# EAGLE design SIMCOM-SIM39EA-MALE (EAGLE 9.5.1)

## Sheet 1 of 2
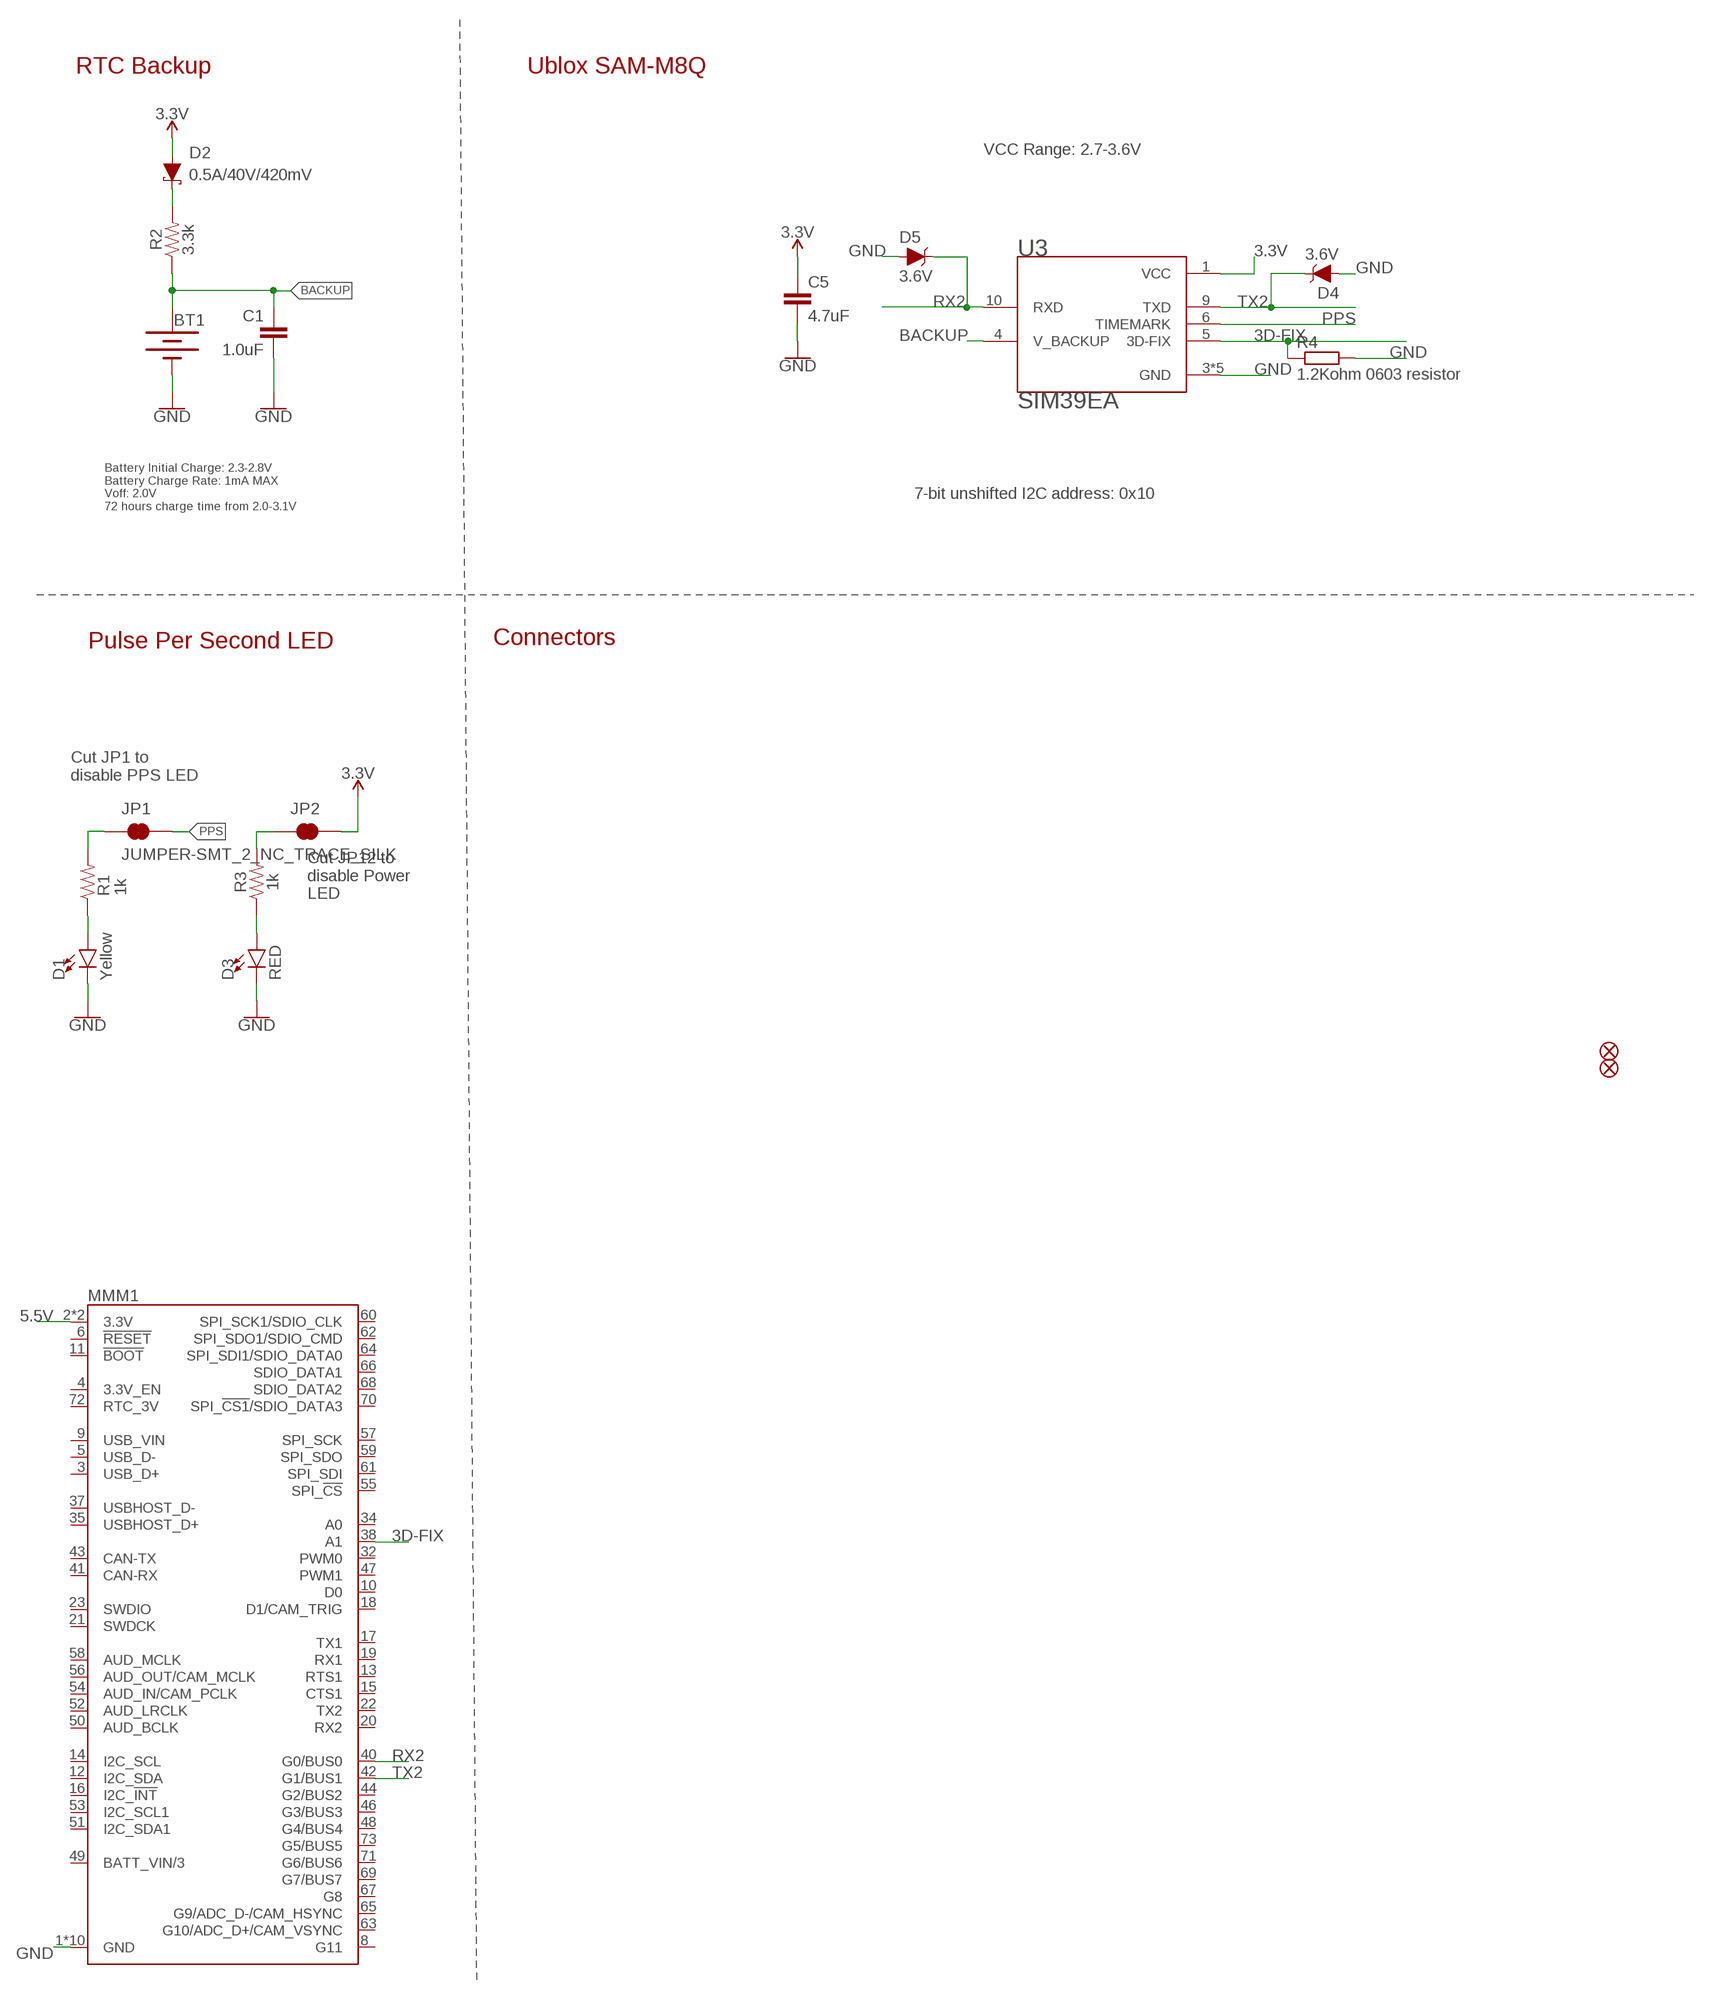
[diagram p0: schematic, sheet 1]

### Parts
BT1  6.8MM_COIN_CELL  ML414H_IV01E_BATTERY  [ML414H_IV01E]
C1  1.0uF  1.0UF-0603-16V-10%  [0603]
C5  4.7uF  4.7UF-0402_TIGHT-6.3V-20%-X5R  [0402-TIGHT]
D1  Yellow  LED-YELLOW0603  [LED-0603]
D2  0.5A/40V/420mV  DIODE-SCHOTTKY-PMEG4005EJ  [SOD-323]
D3  RED  LED-RED0603  [LED-0603]
D4  3.6V  DIODE-ZENER-BZT52C3V6S  [SOD-323]
D5  3.6V  DIODE-ZENER-BZT52C3V6S  [SOD-323]
FD3  FIDUCIALUFIDUCIAL  [FIDUCIAL-MICRO]
FD4  FIDUCIALUFIDUCIAL  [FIDUCIAL-MICRO]
JP1  JUMPER-SMT_2_NC_TRACE_SILK  [SMT-JUMPER_2_NC_TRACE_SILK]
JP2  JUMPER-SMT_2_NC_TRACE_SILK  [SMT-JUMPER_2_NC_TRACE_SILK]
MMM1  MICROMOD_4222_MALE  [MICROMOD_4222_MALE]
R1  1k  1KOHM-0603-1/10W-1%  [0603]
R2  3.3k  3.3KOHM-0603-1/10W-1%  [0603]
R3  1k  1KOHM-0603-1/10W-1%  [0603]
R4  1.2Kohm 0603 resistor  RESISTOR-0603  [R603]
U3  SIM39EA  [DFN1600X1600X750-13N]

### Nets
3.3V: C5.1 D2.A JP2.2 U3.1(VCC) ; also sheet 2
3D-FIX: MMM1.38(A1) R4.1 U3.5(3D-FIX)
5.5V: MMM1.2(3.3V) MMM1.74(3.3V) ; also sheet 2
BACKUP: BT1.+ C1.1 R2.1 U3.4(V_BACKUP)
GND: BT1.- C1.2 C5.2 D1.C D3.C D4.A D5.A MMM1.1(GND) MMM1.7(GND) MMM1.33(GND) MMM1.36(GND) MMM1.39(GND) MMM1.45(GND) MMM1.75(GND) MMM1.GND1(GND) MMM1.GND2(GND) MMM1.GND3(GND) R4.2 U3.3(GND) U3.8(GND) U3.11(GND) U3.12(GND) U3.13(GND) ; also sheet 2
N$1: JP2.1 R3.2
N$2: D1.A R1.1
N$3: D3.A R3.1
N$4: JP1.1 R1.2
N$6: D2.C R2.2
PPS: JP1.2 U3.6(TIMEMARK)
RX2: D5.C MMM1.40(G0/BUS0) U3.10(RXD)
TX2: D4.C MMM1.42(G1/BUS1) U3.9(TXD)
Unconnected: MMM1.3(USB_D+) MMM1.4(3.3V_EN) MMM1.5(USB_D-) MMM1.6(!RESET!) MMM1.8(G11) MMM1.9(USB_VIN) MMM1.10(D0) MMM1.11(!BOOT!) MMM1.12(I2C_SDA) MMM1.13(RTS1) MMM1.14(I2C_SCL) MMM1.15(CTS1) MMM1.16(I2C_!INT!) MMM1.17(TX1) MMM1.18(D1/CAM_TRIG) MMM1.19(RX1) MMM1.20(RX2) MMM1.21(SWDCK) MMM1.22(TX2) MMM1.23(SWDIO) MMM1.32(PWM0) MMM1.34(A0) MMM1.35(USBHOST_D+) MMM1.37(USBHOST_D-) MMM1.41(CAN-RX) MMM1.43(CAN-TX) MMM1.44(G2/BUS2) MMM1.46(G3/BUS3) MMM1.47(PWM1) MMM1.48(G4/BUS4) MMM1.49(BATT_VIN/3) MMM1.50(AUD_BCLK) MMM1.51(I2C_SDA1) MMM1.52(AUD_LRCLK) MMM1.53(I2C_SCL1) MMM1.54(AUD_IN/CAM_PCLK) MMM1.55(SPI_!CS!) MMM1.56(AUD_OUT/CAM_MCLK) MMM1.57(SPI_SCK) MMM1.58(AUD_MCLK) MMM1.59(SPI_SDO) MMM1.60(SPI_SCK1/SDIO_CLK) MMM1.61(SPI_SDI) MMM1.62(SPI_SDO1/SDIO_CMD) MMM1.63(G10/ADC_D+/CAM_VSYNC) MMM1.64(SPI_SDI1/SDIO_DATA0) MMM1.65(G9/ADC_D-/CAM_HSYNC) MMM1.66(SDIO_DATA1) MMM1.67(G8) MMM1.68(SDIO_DATA2) MMM1.69(G7/BUS7) MMM1.70(SPI_!CS1!/SDIO_DATA3) MMM1.71(G6/BUS6) MMM1.72(RTC_3V) MMM1.73(G5/BUS5)

### Notes on the sheet
- RTC Backup | Ublox SAM-M8Q
- VCC Range: 2.7-3.6V
- 7-bit unshifted I2C address: 0x10
- Battery Initial Charge: 2.3-2.8V
  Battery Charge Rate: 1mA MAX
  Voff: 2.0V
  72 hours charge time from 2.0-3.1V
- Pulse Per Second LED | Connectors
- Cut JP1 to 
  disable PPS LED
- Cut JP12 to 
  disable Power 
  LED

## Sheet 2 of 2
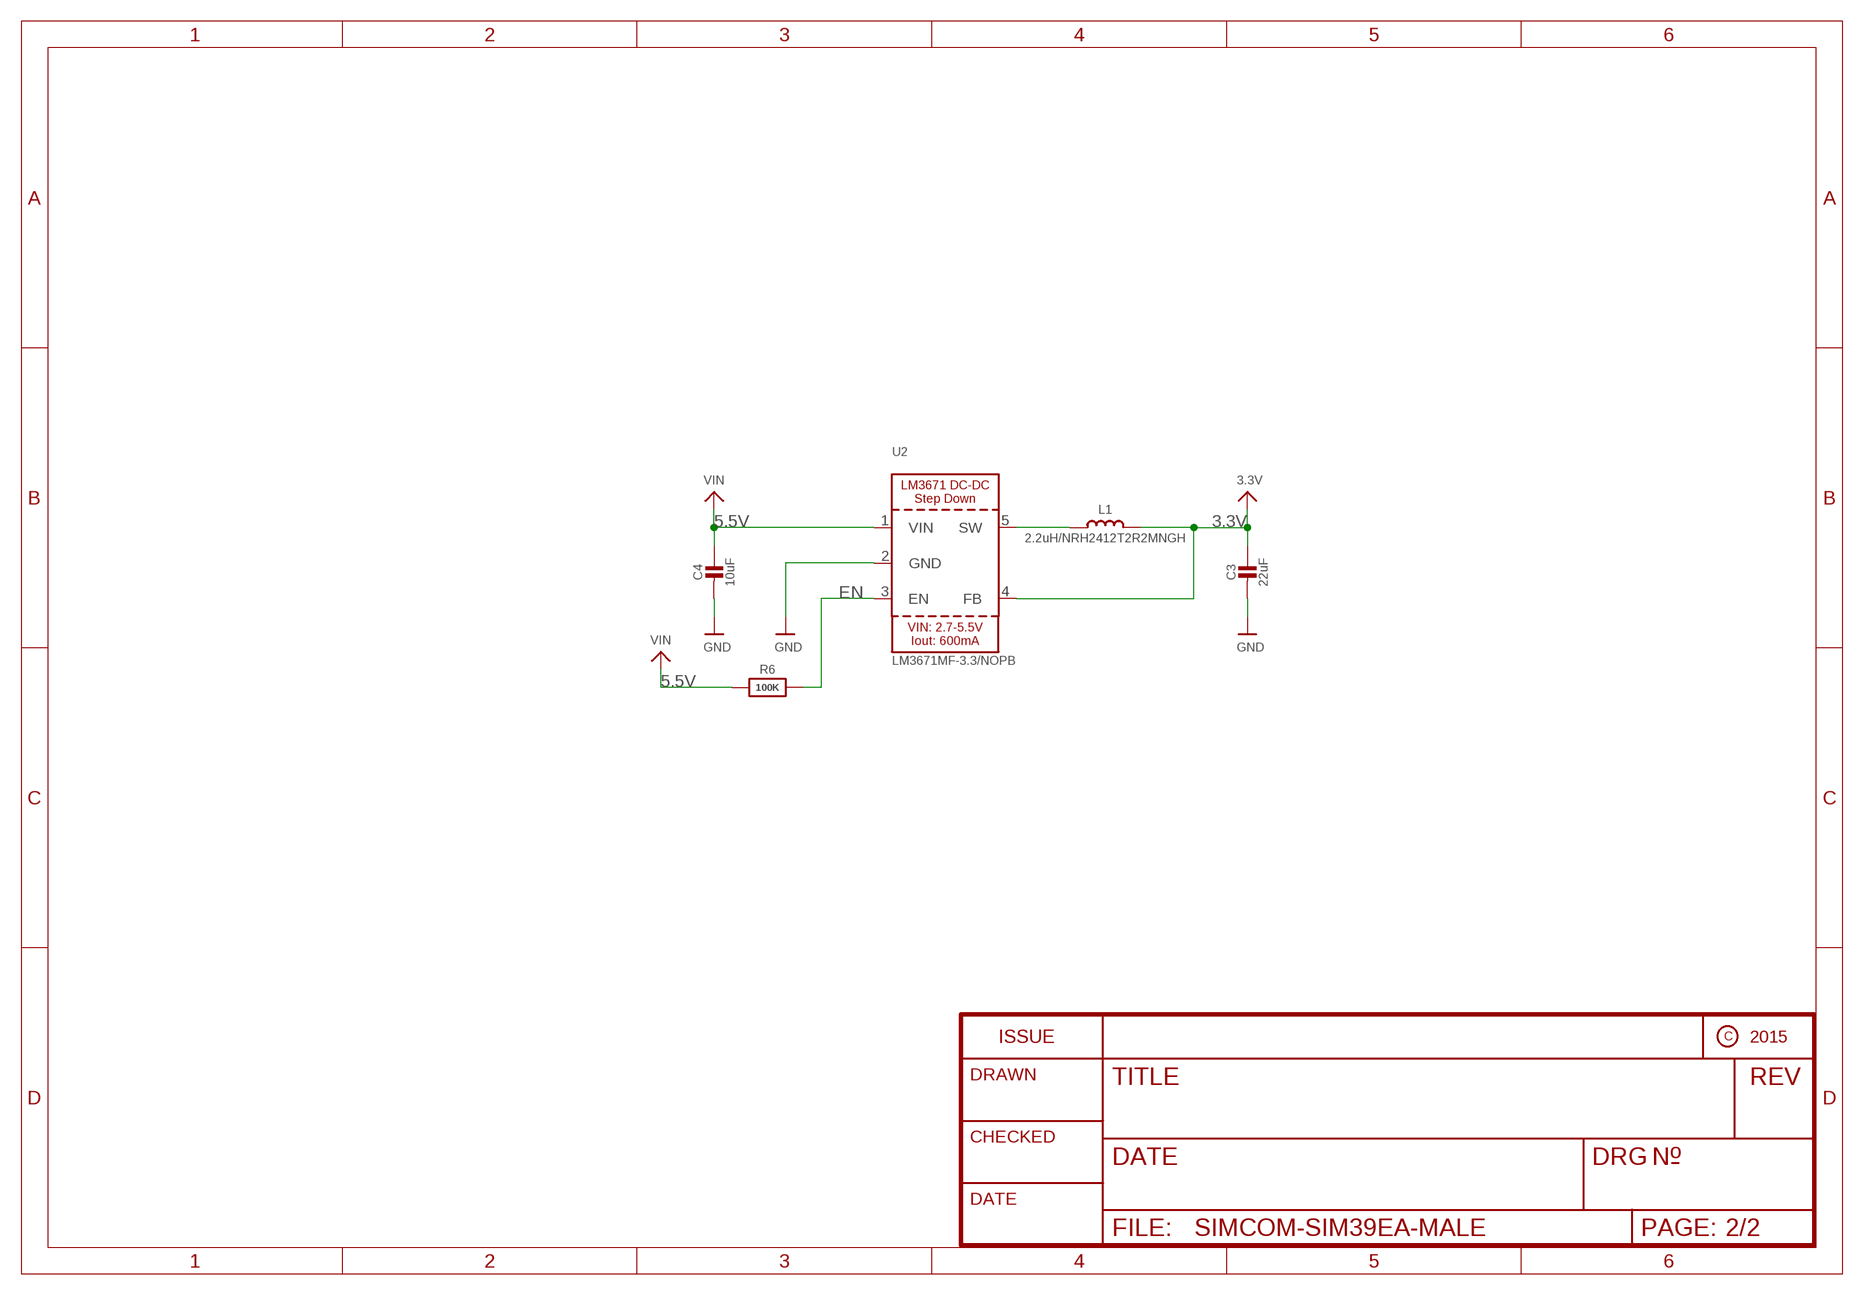
[diagram p1: schematic, sheet 2]

### Parts
C3  22uF  CAP_CERAMIC0805-NOOUTLINE  [0805-NO]
C4  10uF  CAP_CERAMIC0805-NOOUTLINE  [0805-NO]
L1  2.2uH/NRH2412T2R2MNGH  INDUCTORNRH2412T  [INDUCTOR_TAIYOYUDEN_NRH2412T]
R6  100K  RESISTOR0805_NOOUTLINE  [0805-NO]
U2  LM3671MF-3.3/NOPB  VREG_LM3671  [SOT23-5]

### Nets
3.3V: C3.1 L1.2 U2.4(FB) ; also sheet 1
5.5V: C4.1 R6.1 U2.1(VIN) ; supply symbol labelled VIN ; also sheet 1
EN: R6.2 U2.3(EN)
GND: C3.2 C4.2 U2.2(GND) ; also sheet 1
N$5: L1.1 U2.5(SW)

## Library data of the parts
BT1 = SparkFun-Batteries:ML414H_IV01E_BATTERY: SEIKO ML414H-IV01E Reflowable Lithium Battery ML414H is a rechargeable, coin type battery with features such as Pb-free reflowable (Peak temperature: 260 C) and high temperature heat resistance. Battery Characteristics: 3.1V max voltage Voff is 2V 1mAH 3k series resistor with battery 72 hour charge time from 2.0-3.1V 2.3-2.8V initial charge; PROD_ID: BATT-14267
C1 = SparkFun-Capacitors:1.0UF: 1µF ceramic capacitors A capacitor is a passive two-terminal electrical component used to store electrical energy temporarily in an electric field.; PROD_ID: CAP-00868
C3 C4 = microbuilder:CAP_CERAMIC: Ceramic Capacitors For new designs, use the packages preceded by an '_' character since they are more reliable: The following footprints should be used on most boards: _0402 - Standard footprint for regular board layouts _0603 - Standard footprint for regular board layouts _0805 - Standard footprint for regular board layouts _1206 - Standard footprint for regular board layouts For extremely tight-pitch boards where space is at a premium, the following 'micro-pitch' footprints can be used (smaller pads, no silkscreen outline, etc.): _0402MP - Micro-pitch footprint for very dense/compact boards _0603MP - Micro-pitch footprint for very dense/compact boards _0805MP - Micro-pitch footprint for very dense/compact boards _1206MP - Micro-pitch footprint for very dense/compact boards
C5 = SparkFun-Capacitors:4.7UF: 4.7µF ceramic capacitors A capacitor is a passive two-terminal electrical component used to store electrical energy temporarily in an electric field.; PROD_ID: CAP-14240
D1 = SparkFun-LED:LED-YELLOW: Yellow SMD LED Used in manufacturing several products at SparkFun. Packages: 0603 - SMD 0603 package[Product Link] <http://www.kingbrightusa.com/product.asp?catalog_name=LED&product_id=APT1608SYCK> 0603 -SMART - SMART SMD 0603 package (more efficient/more expensive) [Product Link] <http://www.osram-os.com/osram_os/en/products/product-catalog/led-light-emitting-diodes/smartled-0603/ly-l29k/index.jsp> LilyPad - SMD1206 package[Product Datasheet] <https://www.sparkfun.com/datasheets/DevTools/LilyPad/Q150YUS4.pdf> SparkFun Products: Blynk Board <https://www.sparkfun.com/products/13794> IOIO-OTG <https://www.sparkfun.com/products/13613> XBee Explorer Serial <https://www.sparkfun.com/products/13225>; PROD_ID: DIO-09003
D2 = SparkFun-DiscreteSemi:DIODE-SCHOTTKY: Schottky diode A Schottky diode is a semiconductor diode which has a low forward voltage drop and a very fast switching action.; PROD_ID: DIO-10955
D3 = SparkFun-LED:LED-RED: Red SMD LED Used in manufacturing of most products at SparkFun Packages: 0603 - SMD 0603 package [Product Link] <http://docs.avagotech.com/docs/AV02-0551EN> 0603 SMART - SMD 0603 SMART package ( more efficient and expensive)[Product Link] <http://www.osram-os.com/Graphics/XPic2/00077099_0.pdf> 1206 - SMD1206 package [Product Link] <https://www.sparkfun.com/datasheets/DevTools/LilyPad/Q150OVS4.pdff> SparkFun Products: Pro Mini 328 -5V <https://www.sparkfun.com/products/821> RedBoard <https://www.sparkfun.com/products/12757> IOIO-OTG <https://www.sparkfun.com/products/13613>; PROD_ID: DIO-00819
D4 D5 = SparkFun-DiscreteSemi:DIODE-ZENER: Zener Diode A Zener diode allows current to flow from its anode to its cathode like a normal semiconductor diode, but it also permits current to flow in the reverse direction when its "Zener voltage" is reached. - WIkipedia; PROD_ID: DIO-08199
FD3 FD4 = SparkFun-Aesthetics:FIDUCIAL: Fiducial Alignment Points Point-of-reference for pick-and-place machines and other optical instruments.
JP1 JP2 = SparkFun-Jumpers:JUMPER-SMT_2_NC_TRACE: Normally closed trace jumper This jumper has a trace between two pads so it's normally closed (NC). Use a razor knife to open the connection. For best results follow the IPC guidelines for cutting traces: Cutout at least 0.063 mm (0.005 in). Remove all loose material to clean up the cut area. Seal the cut with an approved epoxy. Reapply solder to reclose the connection.
L1 = microbuilder:INDUCTOR: Inductors 0603: 10nH Ceramic Inductor - microwire antenna/RF (Digikey: 712-1434-2-ND) 0805: 560nH Ceramic Inductor - RF (Digikey: 553-1047-1-ND) 270nH Ceramic Inductor - Q = 40@250MHz, +-5%, 1 Ohm DC Resistance (Digikey: 535-10506-2-ND) 1007 (2518 Metric) SMT: 10µH 10% 250mOhm 820mA 1007 Inductor (Digikey: 587-2189-1-ND) 22µH 10% 500mOhm 580mA 1007 Inductor (Digikey: 587-2190-1-ND) 47µH 10% 950mOhm 420mA 1007 Inductor (Digikey: 587-2191-1-ND) 47µH 5% 100mOhm 1A 1008 Inductor (Digikey: 732-1816-1-ND) 5.0x5.0mm (Taiyo Yuden NR5040 Series) 6.8µH 20% 2.3A 64mOhm Inductor (Digikey: 587-2374-2-ND) 5.0x5.0mm (TDK VLC5045 Series) 4.7µH 20% 3.3A 34mOhm Inductor (Digikey: 445-6526-1-ND) 6.8µH 20% 2.7A 46mOhm Inductor (Digikey: 445-6527-1-ND) 6.0x6.0mm (TDK VLC6045 Series) 4.7µH 20% 3.8A 27mOhm Inductor (Digikey: 445-6538-2-ND) 6.8µH 20% 3A 41mOhm Inductor (Digikey: 445-6540-1-ND) 6.2µH 30% 2.2A 45mOhm Inductor (Digikey: SRR5028-6R2YCT-ND) - Not TDK VLC6045 but footprint should match 6.0x6.0mm (TDK SLF6045 Series) 6.8uH 30% 2A 33mOhm Inductor (Digikey: 445-4572-1-ND, Mouser: 810-SLF645T6R8N2R0PF) 6.0x6.0mm (Sumida CDRH5D28 Series) 6.2uH 30% 1.8A 45mOhm Inductor (Digikey: 308-1542-1-ND) Taiyo Yuden NR3015T2R2M - 2.2uH 20% 1.5A (Digikey: 587-1648-2-ND, Mouser: 963-NR3015T2R2M) - Used with TI TPS62172 CoilCraft RFID Transponder Coil - MA5532-AE (For use with AS3935 Lightning Sensor) Taiyo Yuden NRH2412T2R2MNGH - 2.2uH 20% 1AA (Digikey: 587-3443-1-ND) - Used with TI LM3671 Vishay IHLP 1.0uH Molded Inductor - 24mOhm DCR, 5A, +/-20%, -55°C-125°C (Digikey: 541-1319-1-ND)
MMM1 = Micromod_4222_Male:MICROMOD_4222_MALE
R1 R3 = SparkFun-Resistors:1KOHM: 1kΩ resistor A resistor is a passive two-terminal electrical component that implements electrical resistance as a circuit element. Resistors act to reduce current flow, and, at the same time, act to lower voltage levels within circuits. - Wikipedia; PROD_ID: RES-07856
R2 = SparkFun-Resistors:3.3KOHM: 3.3kΩ resistor A resistor is a passive two-terminal electrical component that implements electrical resistance as a circuit element. Resistors act to reduce current flow, and, at the same time, act to lower voltage levels within circuits. - Wikipedia; PROD_ID: RES-07851
R4 = dp_devices:RESISTOR
R6 = microbuilder:RESISTOR: Resistors For new designs, use the packages preceded by an '_' character since they are more reliable: The following footprints should be used on most boards: _0402 - Standard footprint for regular board layouts _0603 - Standard footprint for regular board layouts _0805 - Standard footprint for regular board layouts _1206 - Standard footprint for regular board layouts For extremely tight-pitch boards where space is at a premium, the following 'micro-pitch' footprints can be used (smaller pads, no silkscreen outline, etc.): _0402MP - Micro-pitch footprint for very dense/compact boards _0603MP - Micro-pitch footprint for very dense/compact boards _0805MP - Micro-pitch footprint for very dense/compact boards _1206MP - Micro-pitch footprint for very dense/compact boards
U2 = microbuilder:VREG_LM3671: LM3671 - 600mA DC-DC Step-Down Converter VIN: 2.7-5.5V Load Current: 600mA Switching Frequency: 2MHz Iq: 16uA
U3 = SIM39EA:SIM39EA: Ic Gps Accompany With Patch Antenna; AVAILABILITY: Unavailable; DESCRIPTION: Ic Gps Accompany With Patch Antenna; MF: Simcom; MP: SIM39EA; PACKAGE: None; PRICE: None

## Net classes
0 default: width 0.254 mm
1 vcc: width 0.305 mm

## Board
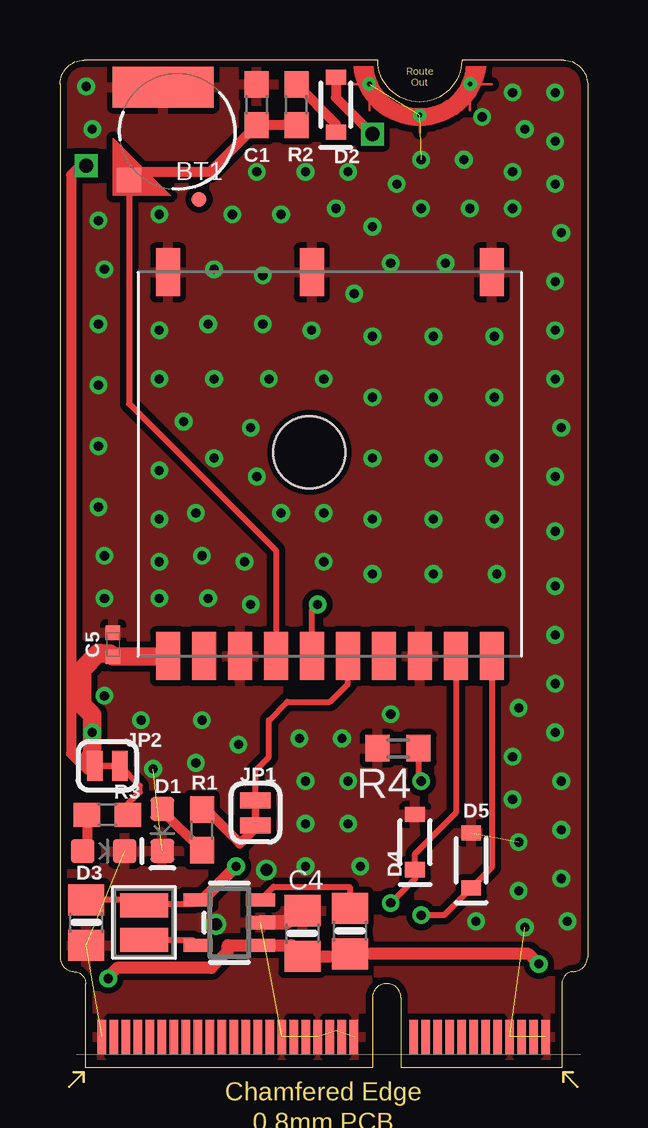
[diagram p2: board, top side]
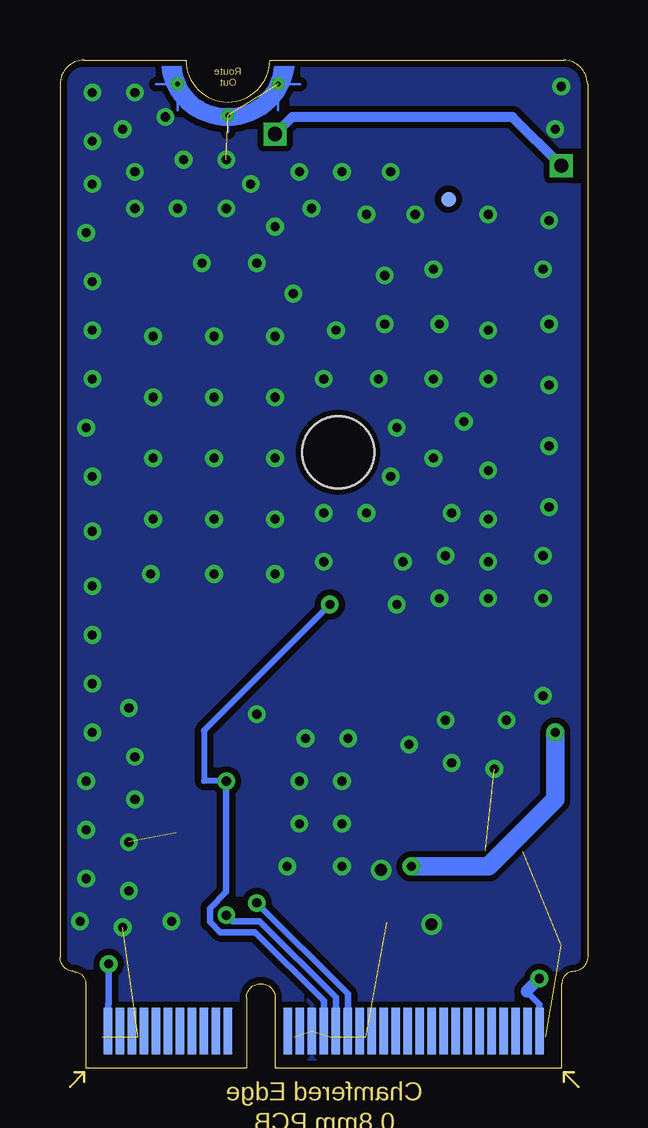
[diagram p3: board, bottom side, seen from below]

Size 22 x 42 mm. Coordinates in mm from the lower left corner, seen from the top.
Copper layers (1*16): Top 0.035mm / dielectric 1.5mm / Bottom 0.035mm
Design rules "SparkFun-2-layer-TIGHT *": minimum track width 7mil, minimum drill 15mil, track to track 7mil, track to pad 7mil, pad to pad 7mil, via to via 7mil, smd to smd 7mil, copper to edge 8mil, drill to drill 8mil, minimum pad ring 7mil, minimum via ring 7mil, stop-mask expansion 4mil, vias tented up to drill 25mil, thermal gap 10mil

### Footprints (pad centres in the part's own frame; a part is rotated, then mirrored left to right if it is on the bottom)
ML414H_IV01E = smd 1 x 1: + 2.022,2.032 | smd 4.2 x 1.7: - 0.6,-1.85
0603 = smd 1.1 x 1: 1 -0.85,0; 2 0.85,0
0805-NO = smd 1.3 x 1.5: 1 -0.95,0; 2 0.95,0
0402-TIGHT = smd 0.6 x 0.6: 1 -0.5,0; 2 0.5,0
LED-0603 = smd 1 x 1: A -0.877,0; C 0.877,0
SOD-323 = smd 0.63 x 0.83: A 1.15,0; C -1.15,0
FIDUCIAL-MICRO = smd 0.635 x 0.635: 1 0,0
SMT-JUMPER_2_NC_TRACE_SILK = smd 0.66 x 1.27: 1 -0.521,0; 2 0.521,0
INDUCTOR_TAIYOYUDEN_NRH2412T = smd 1 x 2: 1 -0.725,0; 2 0.725,0
MICROMOD_4222_MALE = smd 0.35 x 1.45: 1 9.25,1.275; 3 8.75,1.275; 5 8.25,1.275; 7 7.75,1.275; 9 7.25,1.275; 11 6.75,1.275; 13 6.25,1.275; 15 5.75,1.275; 17 5.25,1.275; 19 4.75,1.275; 21 4.25,1.275; 23 3.75,1.275; 33 1.25,1.275; 35 0.75,1.275; 37 0.25,1.275; 39 -0.25,1.275; 41 -0.75,1.275; 43 -1.25,1.275; 45 -1.75,1.275; 47 -2.25,1.275; 49 -2.75,1.275; 51 -3.25,1.275; 53 -3.75,1.275; 55 -4.25,1.275; 57 -4.75,1.275; 59 -5.25,1.275; 61 -5.75,1.275; 63 -6.25,1.275; 65 -6.75,1.275; 67 -7.25,1.275; 69 -7.75,1.275; 71 -8.25,1.275; 73 -8.75,1.275; 75 -9.25,1.275 | smd 0.35 x 1.95 bottom: 2 9,1.525; 4 8.5,1.525; 6 8,1.525; 8 7.5,1.525; 10 7,1.525; 12 6.5,1.525; 14 6,1.525; 16 5.5,1.525; 18 5,1.525; 20 4.5,1.525; 22 4,1.525; 32 1.5,1.525; 34 1,1.525; 36 0.5,1.525; 38 0,1.525; 40 -0.5,1.525; 42 -1,1.525; 44 -1.5,1.525; 46 -2,1.525; 48 -2.5,1.525; 50 -3,1.525; 52 -3.5,1.525; 54 -4,1.525; 56 -4.5,1.525; 58 -5,1.525; 60 -5.5,1.525; 62 -6,1.525; 64 -6.5,1.525; 66 -7,1.525; 68 -7.5,1.525; 70 -8,1.525; 72 -8.5,1.525; 74 -9,1.525 | drill 0.2: GND1 1.9,41; GND2 4,39.7; GND3 6.1,41
R603 = smd 1 x 1.1: 1 -0.85,0; 2 0.85,0
SOT23-5 = smd 0.55 x 1.2: 1 -0.95,-1.3; 2 0,-1.3; 3 0.95,-1.3; 4 0.95,1.3; 5 -0.95,1.3
DFN1600X1600X750-13N = smd 2 x 1: 1 -8,6.75; 2 -8,5.25; 3 -8,3.75; 4 -8,2.25; 5 -8,0.75; 6 -8,-0.75; 7 -8,-2.25; 8 -8,-3.75; 9 -8,-5.25; 10 -8,-6.75; 11 8,-6.75; 12 8,0.75; 13 8,6.75 | hole 3: 0.5,0.85

### Placement (x,y rotation side)
BT1  4.9,39.01 180 top
C1  8.21,40.13 90 top
C3  1.09,6.04 270 top
C4  10.11,5.59 90 top
C5  2.21,17.63 90 top
D1  4.27,9.91 270 top
D2  11.51,40.13 90 top
D3  1.82,9.02 0 top
D4  14.81,9.4 90 top
D5  17.15,8.64 90 top
FD3  5.79,36.19 0 top
FD4  5.79,36.19 0 bottom
JP1  8.16,10.62 90 top
JP2  1.98,12.57 180 top
L1  3.51,6.04 90 top
MMM1  11,0 0 top
R1  5.92,9.91 90 top
R2  9.86,40.13 90 top
R3  1.98,10.54 0 top
R4  14.1,13.31 180 top
R6  12.09,5.69 90 top
U2  7.06,6.04 90 top
U3  11.25,25.15 90 top

### Tracks (layer width: path | path; a pad name or v marks a point on that pad's centre or on a via)
3.3V  (via drill 0.38, 0.6)
  Top 0.254: 5.95,6.99 U2.4 5.57,6.81 3.54,6.81 L1.2 | L1.2 3.41,6.67 3,6.67 | L1.2 3.28,6.99 C3.1
  Top 0.406: v1.09,37.59 0.84,37.59 0.46,37.22 0.46,13.08 0.97,12.57 1.23,12.57 JP2.2 | D2.A 11.51,40.44 v13.03,38.91
  Top 0.508: v7.34,8.38 5.95,6.99
  Top 0.762: U3.1 4.49,17.13 C5.1 2.07,17.27 1.68,17.27 1.6,17.27 0.93,16.6 0.93,15.11 1.35,14.69 v1.35,13.97 1.35,13.05 1.23,12.93 1.23,12.57
  Bottom 0.406: v1.09,37.59 3.13,39.62 12.32,39.62 v13.03,38.91
  Bottom 0.762: v7.34,8.38 4.14,8.38 1.35,11.18 v1.35,13.97
3D-FIX  (via drill 0.38)
  Top 0.254: U3.5 10.5,19.06 v10.75,19.3 | R4.1 14.95,12.05 v15.06,11.94
  Bottom 0.254: v10.75,19.3 16,14.05 16,11.94 v15.06,11.94
  Bottom 0.279: v15.06,11.94 15.06,7.32 15.75,6.63 15.75,6.07 15.32,5.64 13.87,5.64 11,2.77 MMM1.38
5.5V  (via drill 0.38)
  Top 0.254: 9.65,5.09 C4.1 | 11.99,4.64 R6.1
  Top 0.508: v2.01,3.71 1.98,3.73 1.98,3.76 2.38,4.16 6.31,4.16 6.99,4.84 6.99,5.09 U2.1 9.65,5.09 | v19.97,4.32 19.55,4.74 R6.1 | C4.1 11.99,4.64
  Bottom 0.279: 2.55,3.17 2.01,2.63 MMM1.74 | v19.97,4.32 19.97,2.66 19.99,2.63 MMM1.2
  Bottom 0.508: v2.01,3.71 2.55,3.17
BACKUP
  Top 0.254: BT1.+ 2.88,27.68 9,21.55 U3.4
  Top 0.406: R2.1 C1.1 6.26,37.34 2.88,37.34 BT1.+
EN
  Top 0.254: U2.3 8.91,7.54 9.66,7.54 9.68,7.52 12.09,7.52 R6.2
GND  (via drill 0.38, 0.5)  (12 unrouted)
  Top 0.61: U2.2 9.42,6.04 10.11,6.73
  other vias: 1.6,30.99 13.03,30.48 15.57,30.48 18.11,30.48 1.6,25.91 13.03,25.4 15.57,25.4 18.11,25.4 1.6,28.45 13.03,27.94 15.57,27.94 18.11,27.94 3.38,14.48 20.65,16 4.14,35.56 8.46,30.99 1.6,35.31 11,28.7 10.49,30.73 9.22,23.11 8.21,24.64 5.92,14.48 4.14,24.89 20.91,34.8 1.6,23.37 13.03,22.86 15.57,22.86 18.11,22.86 20.65,32.77 1.86,21.34 4.14,28.7 8.71,28.7 6.43,25.4 7.19,35.56 9.22,35.56 13.03,35.05 18.87,11.18 12.27,32.26 1.86,19.56 17.35,6.1 11,21.08 20.65,22.35 20.65,20.07 20.91,9.91 1.86,15.49 11,23.11 20.65,28.7 20.65,30.73 21.16,6.1 9.98,13.72 20.65,18.03 6.17,30.99 7.44,13.46 5.67,12.7 12.02,37.34 19.13,9.4 6.43,33.27 20.91,11.94 20.65,13.97 19.13,14.99 20.91,7.87 10.24,11.94 10.24,37.34 10.24,10.16 19.13,7.37 4.14,22.86 19.38,5.84 20.65,36.83 7.95,26.67 20.65,40.64 18.87,40.64 6.43,28.7 4.14,30.73 11.51,35.81 8.46,33.02 13.79,33.53 5.16,26.92 18.87,35.81 15.06,35.81 15.06,37.85 16.84,37.85 18.87,37.34 20.91,26.67 1.86,33.27 17.1,35.81 20.65,24.64 16.08,33.53 3.89,12.45 20.65,38.61 19.38,39.12 17.6,39.62 1.09,40.89 1.35,39.12 8.21,37.34 18.87,12.95 14.05,36.83 6.5,5.97 8.61,8.23 4.14,21.08 4.14,19.56 6.17,19.56 7.95,19.3 5.92,21.34 5.67,23.11 7.7,21.08 11.76,13.72 12.02,11.94 12.02,10.16 13.79,14.73 12.52,8.38 10.24,8.38 13.03,20.57 15.57,20.57 18.21,20.57
  pour Bottom (isolate 0.254): -0.18,42.67 22.68,42.67 22.68,0.51 -0.18,0.51
  pour Top (isolate 0.254): -0.18,42.67 22.68,42.67 22.68,0.51 -0.18,0.51
N$1
  Top 0.254: R3.2 2.83,10.98 3.33,11.48 3.33,11.74 JP2.1
N$2
  Top 0.406: D1.A 4.27,10.71 R1.1
N$3
  Top 0.406: R3.1 1.13,9.2 D3.A
N$4
  Top 0.406: R1.2 6.09,10.76 7.5,9.34 8.15,9.99 JP1.1
N$5
  Top 0.254: L1.1 5.54,5.32 U2.5
N$6
  Top 0.406: D2.C 11.51,39.33 R2.2
PPS
  Top 0.254: JP1.2 8.15,12.39 8.71,12.95 8.71,14.48 9.48,15.24 11.25,15.24 12,15.99 U3.6
RX2  (via drill 0.38)
  Top 0.254: U3.10 18,8.34 D5.C 16.01,6.35 v15.06,6.35
  Bottom 0.279: v15.06,6.35 14.81,6.1 13.68,6.1 10.5,2.92 MMM1.40
TX2  (via drill 0.38)
  Top 0.254: U3.9 16.5,10.61 14.81,8.91 D4.C 14.81,7.87 v13.79,6.86
  Bottom 0.279: v13.79,6.86 10,3.06 MMM1.42